# EasyEDA schematic Schematic_Moscow-128_v1.1.0.json
TITLE: Москва-128К; REV: 1.1.0; Date: 2024-11-11; Sheet: 1/1; Drawn By: Roman Boykov; Company: zx-pk.ru
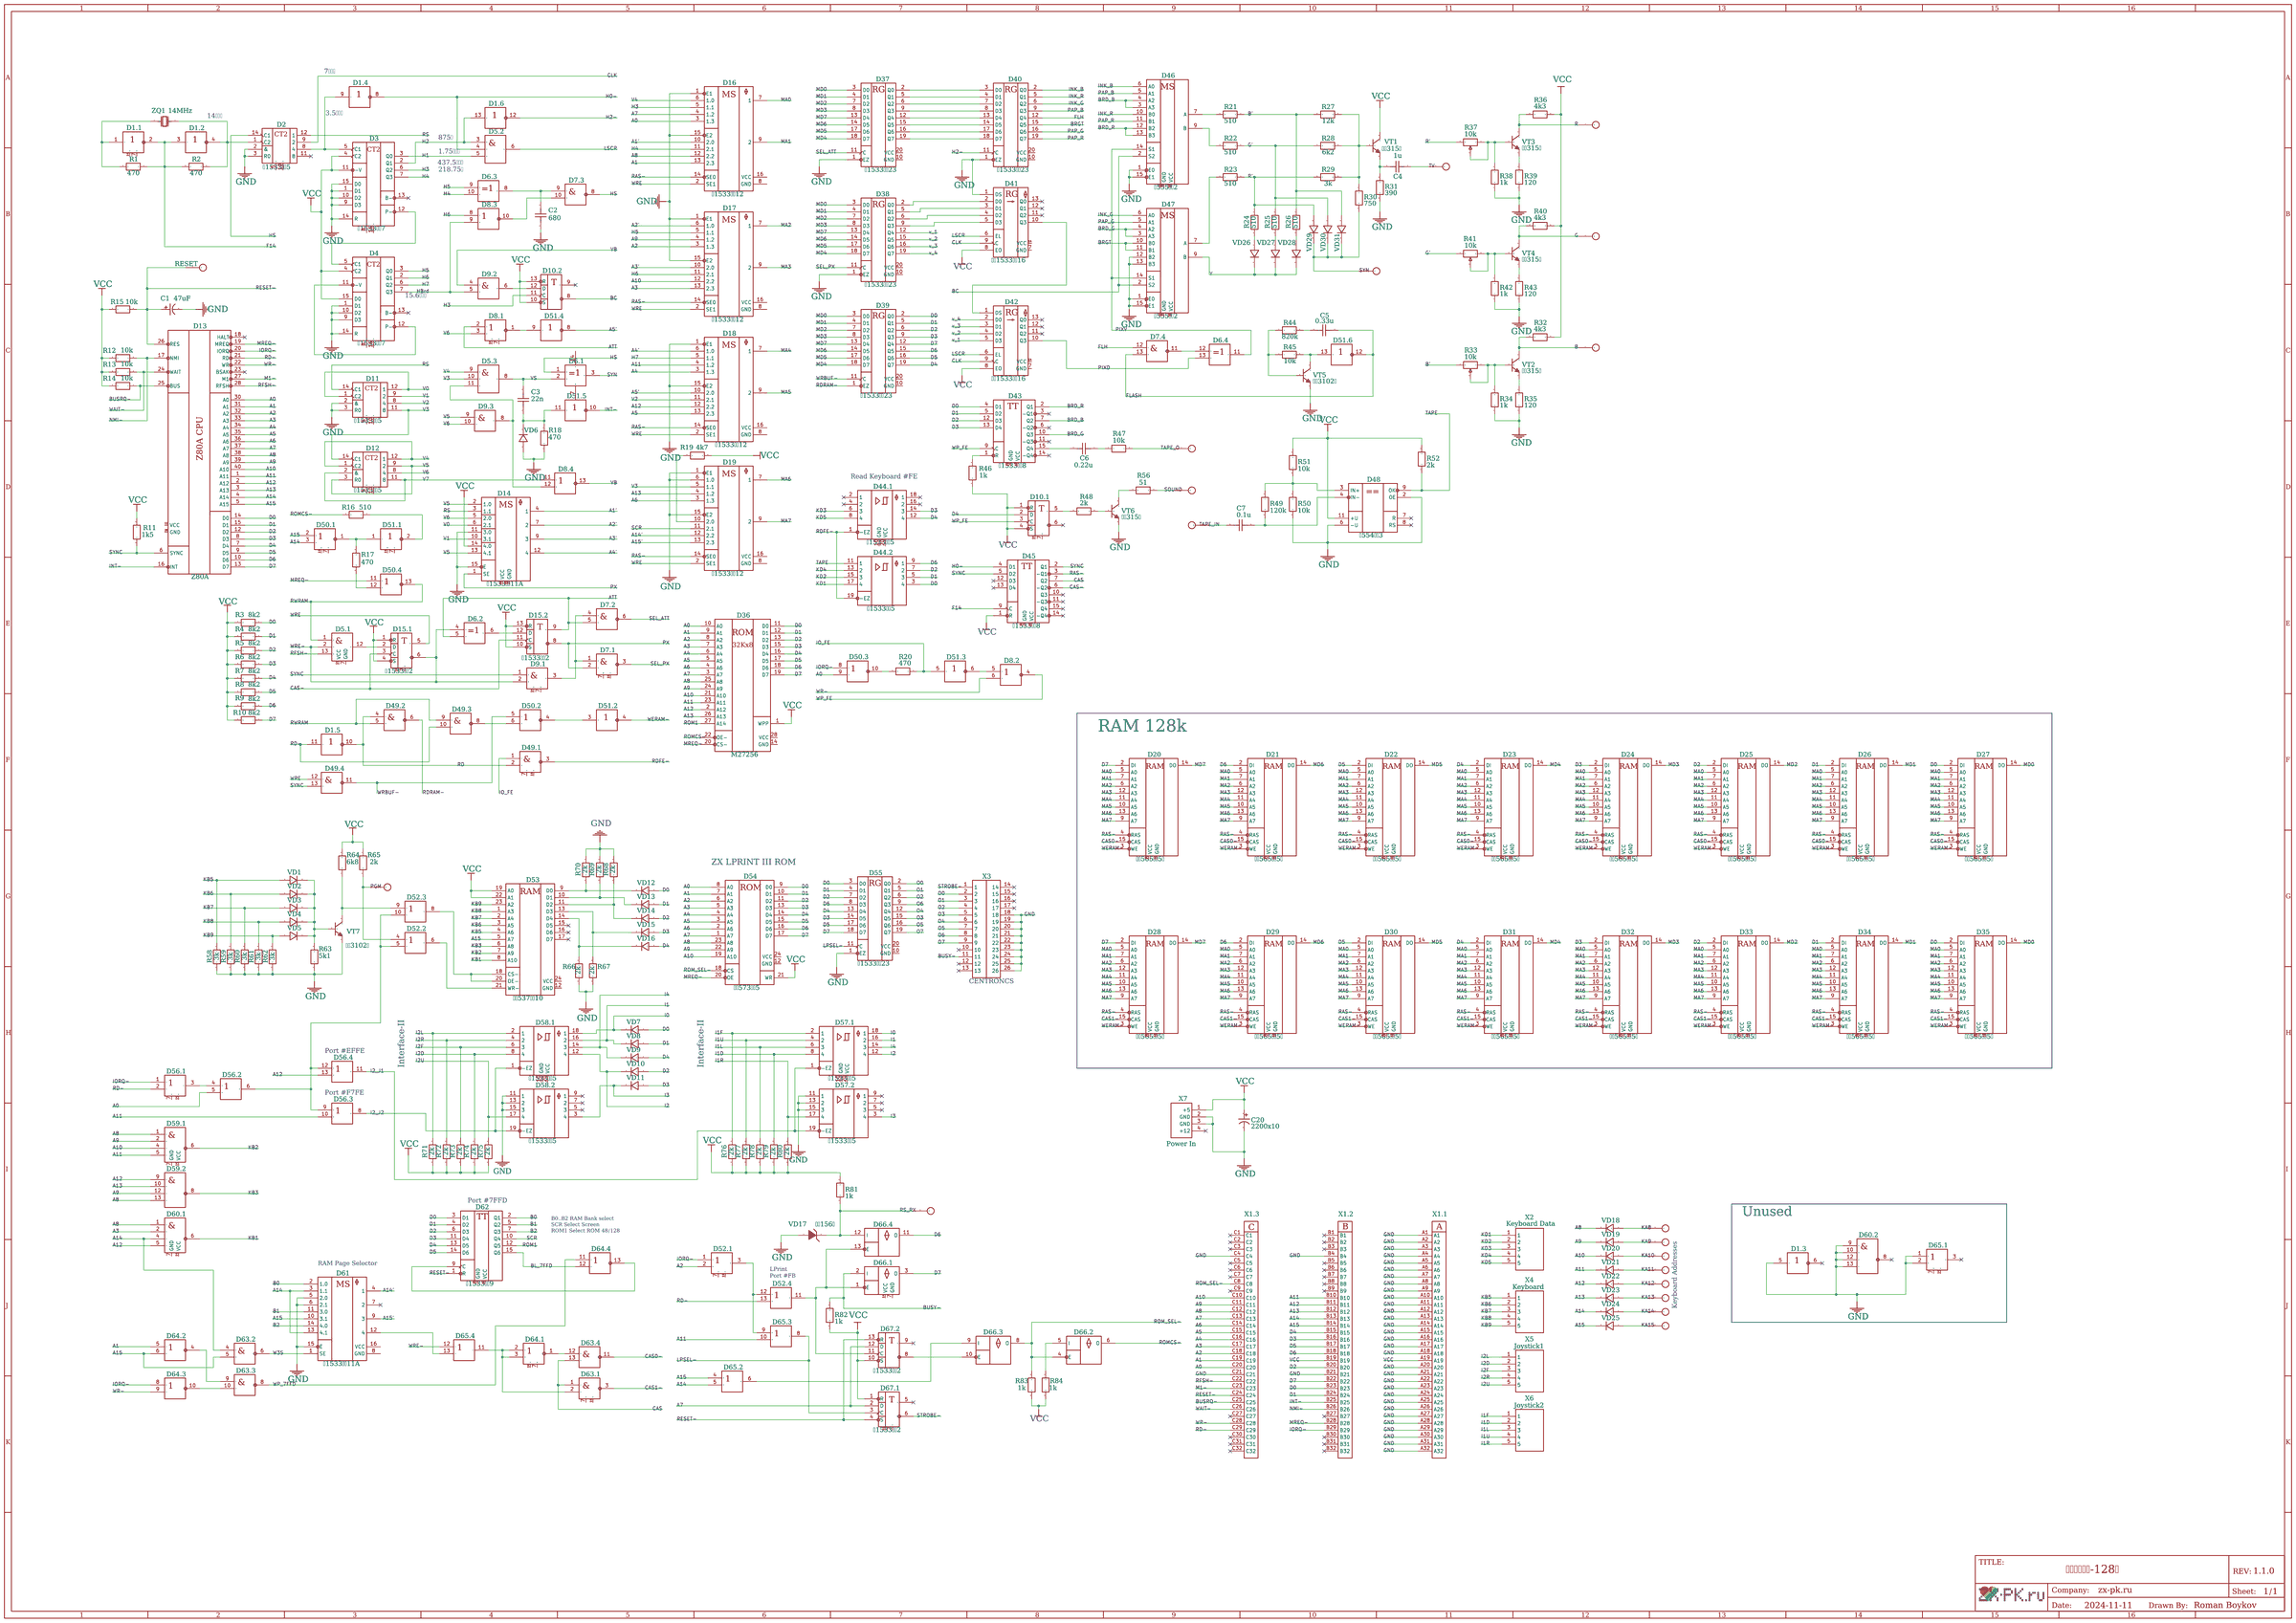
[diagram p0: schematic sheet]

## Parts
C1  47uF  [CAP-TH_BD5.0-P2.50-D1.0-FD]
C2  680  [CAP-TH_L5.08]
C3  22n  [CAP-TH_L5.08]
C4  1u  [CAP-TH_L5.08]
C5  0.33u  [CAP-TH_L5.08]
C6  0.22u  [CAP-TH_L5.08]
C7  0.1u  [CAP-TH_L5.08]
C20  2200x10  [CAP-TH_BD12.5-P5.00-D0.6-FD]
D1  К1533ЛН1  [DIP-14_STD]  (sections 1,2,3,4,5,6)
D2  К1533ИЕ5  [DIP-14_STD]
D3  К1533ИЕ7  [DIP-16_STD]
D4  К1533ИЕ7  [DIP-16_STD]
D5  К1533ЛИ3  [DIP-14_STD]  (sections 1,2,3)
D6  К1533ЛП5  [DIP-14_STD]  (sections 1,2,3,4)
D7  К1533ЛА3  [DIP-14_STD]  (sections 1,2,3,4)
D8  К1533ЛЕ1  [DIP-14_STD]  (sections 1,2,3,4)
D9  К1533ЛИ1  [DIP-14_STD]  (sections 1,2,3)
D10  К1533ТМ2  [DIP-14_STD]  (sections 1,2)
D11  К1533ИЕ5  [DIP-14_STD]
D12  К1533ИЕ5  [DIP-14_STD]
D13  Z80A  [DIP-40_STD]
D14  К1533КП11A  [DIP-16_STD]
D15  К1533ТМ2  [DIP-14_STD]  (sections 1,2)
D16  К1533КП12  [DIP-16_STD]
D17  К1533КП12  [DIP-16_STD]
D18  К1533КП12  [DIP-16_STD]
D19  К1533КП12  [DIP-16_STD]
D20  КР565РУ5Г  [DIP-16_STD]
D21  КР565РУ5Г  [DIP-16_STD]
D22  КР565РУ5Г  [DIP-16_STD]
D23  КР565РУ5Г  [DIP-16_STD]
D24  КР565РУ5Г  [DIP-16_STD]
D25  КР565РУ5Г  [DIP-16_STD]
D26  КР565РУ5Г  [DIP-16_STD]
D27  КР565РУ5Г  [DIP-16_STD]
D28  КР565РУ5Г  [DIP-16_STD]
D29  КР565РУ5Г  [DIP-16_STD]
D30  КР565РУ5Г  [DIP-16_STD]
D31  КР565РУ5Г  [DIP-16_STD]
D32  КР565РУ5Г  [DIP-16_STD]
D33  КР565РУ5Г  [DIP-16_STD]
D34  КР565РУ5Г  [DIP-16_STD]
D35  КР565РУ5Г  [DIP-16_STD]
D36  M27256  [DIP-28_STD]
D37  К1533ИР23  [DIP-20_STD]
D38  К1533ИР23  [DIP-20_STD]
D39  К1533ИР23  [DIP-20_STD]
D40  К1533ИР23  [DIP-20_STD]
D41  КР1533ИР16  [DIP-14_STD]
D42  КР1533ИР16  [DIP-14_STD]
D43  К1533ТМ8  [DIP-16_STD]
D44  К1533АП5  [DIP-20_STD]  (sections 1,2)
D45  К1533ТМ8  [DIP-16_STD]
D46  К555КП2  [DIP-16_STD]
D47  К555КП2  [DIP-16_STD]
D48  К554СА3  [DIP-14_STD]
D49  К1533ЛА3  [DIP-14_STD]  (sections 1,2,3,4)
D50  К1533ЛЕ1  [DIP-14_STD]  (sections 1,2,3,4)
D51  К1533ЛН1  [DIP-14_STD]  (sections 1,2,3,4,5,6)
D52  К1533ЛЛ1  [DIP-14_STD]  (sections 1,2,3,4)
D53  КР537РУ10  [DIP-24_STD]
D54  КР573РФ5  [DIP-24_STD]
D55  К1533ИР23  [DIP-20_STD]
D56  К1533ЛЛ1  [DIP-14_STD]  (sections 1,2,3,4)
D57  К1533АП5  [DIP-20_STD]  (sections 1,2)
D58  К1533АП5  [DIP-20_STD]  (sections 1,2)
D59  К1533ЛА1  [DIP-14_STD]  (sections 1,2)
D60  К1533ЛА1  [DIP-14_STD]  (sections 1,2)
D61  К1533КП11A  [DIP-16_STD]
D62  К1533ТМ9  [DIP-16_STD]
D63  К1533ЛА3  [DIP-14_STD]  (sections 1,2,3,4)
D64  К1533ЛЕ1  [DIP-14_STD]  (sections 1,2,3,4)
D65  К1533ЛЛ1  [DIP-14_STD]  (sections 1,2,3,4)
D66  К155ЛП8  [DIP-14_STD]  (sections 1,2,3,4)
D67  К1533ТМ2  [DIP-14_STD]  (sections 1,2)
R1  470  [R_0.125_5.08]
R2  470  [R_0.125_5.08]
R3  8k2  [R_0.125_7.62]
R4  8k2  [R_0.125_7.62]
R5  8k2  [R_0.125_5.08]
R6  8k2  [R_0.125_7.62]
R7  8k2  [R_0.125_5.08]
R8  8k2  [R_0.125_7.62]
R9  8k2  [R_0.125_V_TH]
R10  8k2  [R_0.125_V_TH]
R11  1k5  [R_0.125_7.62]
R12  10k  [R_0.125_7.62]
R13  10k  [R_0.125_7.62]
R14  10k  [R_0.125_7.62]
R15  10k  [R_0.125_7.62]
R16  510  [R_0.125_L6.35]
R17  470  [R_0.125_L6.35]
R18  470  [R_0.125_7.62]
R19  4k7  [R_0.125_7.62]
R20  470  [R_0.125_7.62]
R21  510  [R_0.125_5.08]
R22  510  [R_0.125_5.08]
R23  510  [R_0.125_5.08]
R24  510  [R_0.125_5.08]
R25  510  [R_0.125_5.08]
R26  510  [R_0.125_5.08]
R27  12k  [R_0.125_5.08]
R28  6k2  [R_0.125_5.08]
R29  3k  [R_0.125_5.08]
R30  750  [R_0.125_5.08]
R31  390  [R_0.125_V_TH]
R32  4k3  [R_0.125_5.08]
R33  10k  [RV_3266W_P2.54]
R34  1k  [R_0.125_V_TH]
R35  120  [R_0.125_5.08]
R36  4k3  [R_0.125_5.08]
R37  10k  [RV_3266W_P2.54]
R38  1k  [R_0.125_V_TH]
R39  120  [R_0.125_5.08]
R40  4k3  [R_0.125_5.08]
R41  10k  [RV_3266W_P2.54]
R42  1k  [R_0.125_V_TH]
R43  120  [R_0.125_5.08]
R44  820k  [R_0.125_7.62]
R45  10k  [R_0.125_5.08]
R46  1k  [R_0.125_7.62]
R47  10k  [R_0.125_5.08]
R48  2k  [R_0.125_5.08]
R49  120k  [R_0.125_5.08]
R50  10k  [R_0.125_5.08]
R51  10k  [R_0.125_5.08]
R52  2k  [R_0.125_5.08]
R56  51  [R_0.125_5.08]
R58  3k  [R_0.125_5.08]
R59  3k  [R_0.125_5.08]
R60  3k  [R_0.125_5.08]
R61  3k  [R_0.125_5.08]
R62  3k  [R_0.125_5.08]
R63  5k1  [R_0.125_5.08]
R64  6k8  [R_0.125_7.62]
R65  2k  [R_0.125_7.62]
R66  2k  [R_0.125_5.08]
R67  2k  [R_0.125_5.08]
R68  2k  [R_0.125_5.08]
R69  2k  [R_0.125_5.08]
R70  2k  [R_0.125_5.08]
R71  2k  [R_0.125_5.08]
R72  2k  [R_0.125_5.08]
R73  2k  [R_0.125_5.08]
R74  2k  [R_0.125_5.08]
R75  2k  [R_0.125_5.08]
R76  2k  [R_0.125_5.08]
R77  2k  [R_0.125_5.08]
R78  2k  [R_0.125_5.08]
R79  2k  [R_0.125_5.08]
R80  2k  [R_0.125_5.08]
R81  1k  [R_0.125_V_TH]
R82  1k  [R_0.125_V_TH]
R83  1k  [R_0.125_5.08]
R84  1k  [R_0.125_7.62]
TP1  TO  [TH-TEST-1]
TP2  SO  [TH-TEST-1]
TP3  TI  [TH-TEST-1]
TP4  RESET  [TH-TEST-1]
TP5  KA8  [TH-TEST-1]
TP6  KA9  [TH-TEST-1]
TP7  KA10  [TH-TEST-1]
TP8  KA11  [TH-TEST-1]
TP9  KA12  [TH-TEST-1]
TP10  KA13  [TH-TEST-1]
TP11  KA14  [TH-TEST-1]
TP12  KA15  [TH-TEST-1]
TP13  R  [TH-TEST-1]
TP14  G  [TH-TEST-1]
TP15  B  [TH-TEST-1]
TP16  SYNC  [TH-TEST-1]
TP17  BW/TV  [TH-TEST-1]
TP18  RS_RX  [TH-TEST-1]
TP19  PGM  [TH-TEST-1]
VD1  1N4148  [D_TH_3_3.81V]
VD2  1N4148  [D_TH_3_3.81V]
VD3  1N4148  [D_TH_3_3.81V]
VD4  1N4148  [D_TH_3_3.81V]
VD5  1N4148  [D_TH_3_3.81V]
VD6  1N4148  [D_TH_7.62]
VD7  1N4148  [DO-35_TH_5.08V]
VD8  1N4148  [DO-35_TH_5.08V]
VD9  1N4148  [DO-35_TH_5.08V]
VD10  1N4148  [DO-35_TH_5.08V]
VD11  1N4148  [DO-35_TH_5.08V]
VD12  1N4148  [DO-35_TH_5.08V]
VD13  1N4148  [DO-35_TH_5.08V]
VD14  1N4148  [DO-35_TH_5.08V]
VD15  1N4148  [DO-35_TH_5.08V]
VD16  1N4148  [DO-35_TH_5.08V]
VD17  КС156А  [D_TH_3_3.81V]
VD18  1N4148  [D_TH_7.62]
VD19  1N4148  [D_TH_7.62]
VD20  1N4148  [D_TH_7.62]
VD21  1N4148  [D_TH_7.62]
VD22  1N4148  [D_TH_7.62]
VD23  1N4148  [D_TH_7.62]
VD24  1N4148  [D_TH_7.62]
VD25  1N4148  [D_TH_7.62]
VD26  1N4148  [D_TH_5.08V]
VD27  1N4148  [D_TH_5.08V]
VD28  1N4148  [D_TH_5.08V]
VD29  1N4148  [D_TH_5.08V]
VD30  1N4148  [D_TH_5.08V]
VD31  1N4148  [D_TH_5.08V]
VT1  КТ315Б  [KT315_STD]
VT2  КТ315Б  [KT315_STD]
VT3  КТ315Б  [KT315_STD]
VT4  КТ315Б  [KT315_STD]
VT5  КТ3102Б  [KT-1-7]
VT6  КТ315Б  [KT315_STD]
VT7  КТ3102Б  [KT-1-7]
X1  DIN41612C-96FR  [DIN41612C-96FR]  (sections 1,2,3)
X2  Keyboard Data  [HDR-TH_5P-P2.54]
X3  IDC-TH-26P  [IDC-TH_26P-P2.54M]
X4  Keyboard  [HDR-TH_5P-P2.54]
X5  Joystick1  [HDR-TH_5P-P2.54]
X6  Joystick2  [HDR-TH_5P-P2.54]
X7  Power In  [CONN-TH-4P-JVC_MINI]
ZQ1  14MHz  [OSC-49U-1]

## Library data of the parts
C1 = ECLJ0612220M101P00: Supplier: LCSC; Supplier Part: C156809; Manufacturer: Guangdong TOPAZ Elec Tech; Contributor: LCSC
C2-C7 = CK45-R3AD152K-VRY: Supplier: LCSC; Supplier Part: C340608; Manufacturer: TDK; Contributor: LCSC
C20 = 35ZLJ1200MG412.5X25: Supplier: LCSC; Supplier Part: C1646592; Manufacturer: rubycon(红宝石); link: https://atta.szlcsc.com/upload/public/pdf/source/20210511/C1646592_079297B36C73E9CBE03F43750192AD47.pdf; Contributor: lcsc; JLCPCB Part Class: Extended Part
D1 D51 = К1533ЛН1: Supplier: chipdip; Contributor: Roman Boykov; subpart_no: 7
D2 D11 D12 = К1533ИЕ5: Supplier: chipdip; Contributor: romychs_4693; subpart_no: 4
D3 D4 = К1533ИЕ7: Contributor: romychs_4693
D5 = КР1533ЛИ3: Contributor: romychs_4693; subpart_no: 1
D6 = К1533ЛП5: Supplier: chipdip; Contributor: Roman Boykov; subpart_no: 3
D7 = К1533ЛА3: Supplier: chipdip; Contributor: Roman Boykov; subpart_no: 3
D8 = К1533ЛЕ1: Supplier: chipdip; Contributor: Roman Boykov; subpart_no: 3
D9 = К1533ЛИ1: Supplier: chipdip; Contributor: Roman Boykov; subpart_no: 3
D10 D15 D67 = К1533ТМ2: Supplier: chipdip; Contributor: romychs_4693; subpart_no: 4
D13 = Z80A: Manufacturer: Zilog; Contributor: romychs_4693
D14 D61 = К1533КП11A: Supplier: chipdip; Contributor: Roman Boykov
D16-D19 = К1533КП12: Supplier: chipdip; Contributor: romychs_4693
D20-D35 = КР565РУ5Г: Supplier: chipdip; Contributor: romychs_4693
D36 = M27256: Supplier: chipdip; Contributor: romychs_4693
D37-D40 D55 = К1533ИР23: Supplier: chipdip; link: TTL; Регистр; ИР23; Contributor: romychs_4693
D41 D42 = КР1533ИР16: Supplier: chipdip; Contributor: romychs_4693
D43 D45 = К1533ТМ8: Supplier: chipdip; Contributor: Roman Boykov
D44 D57 D58 = К1533АП5: Contributor: romychs_4693; subpart_no: 1
D46 D47 = К555КП2: Supplier: chipdip; Contributor: romychs_4693
D48 = К554СА3: Contributor: romychs_4693
D49 D63 = К1533ЛА3: Supplier: chipdip; Contributor: Roman Boykov; subpart_no: 1
D50 D64 = К1533ЛЕ1: Supplier: chipdip; Contributor: Roman Boykov; subpart_no: 1
D52 D56 D65 = К1533ЛЛ1: Supplier: chipdip; Contributor: Roman Boykov; subpart_no: 3
D53 = КР537РУ10: Contributor: romychs_4693
D54 = КР573РФ5: Contributor: Roman Boykov
D59 = К1533ЛА1: Supplier: chipdip; Contributor: romychs_4693; subpart_no: 1
D60 = К1533ЛА1: Supplier: chipdip; Contributor: romychs_4693; subpart_no: 2
D62 = К1533ТМ9: Supplier: chipdip; Contributor: Roman Boykov
D66 = К155ЛП8: Contributor: Roman Boykov; subpart_no: 1
R1-R32 R34-R36 R38-R40 R42-R52 R56 R58-R84 = RN 1/8W 470R F T/B A1: Supplier: LCSC; Supplier Part: C433478; Manufacturer: TyoHM; Contributor: LCSC
R33 R37 R41 = R_3386P_EU: Supplier: LCSC; Contributor: LCEDA_Lib; Value(Ω): 10K
TP1-TP19 = TH-TEST-1: Contributor: romychs_4693
VD1-VD16 VD18-VD31 = 1N4148: Contributor: EasyEDA
VD17 = 1N4742A: Supplier: LCSC; Manufacturer: Tak Cheong; Supplier Part: C113210; JLCPCB Part Class: Extended Part
VT1-VT4 VT6 = КТ315Б: Supplier: LCSC; Manufacturer: Russia; Manufacturer Part: КТ315; Supplier Part: КТ315; JLCPCB Part Class: Extended Part
VT5 VT7 = КТ3102Б: Supplier: LCSC; Manufacturer: Russia; Manufacturer Part: КТ315; Supplier Part: КТ315; JLCPCB Part Class: Extended Part
X1 = DIN41612C-96FR: Contributor: Roman Boykov; subpart_no: 1
X2 X4-X6 = PinHeader_1x5: Contributor: Roman Boykov
X3 = IDC-TH-26P: Contributor: Roman Boykov
X7 = JVC Mini-4P: Contributor: romychs_4693
ZQ1 = X49UD12MSD2SC: Supplier: LCSC; Manufacturer: YXC; Supplier Part: C2188

## Nets
GND: C1.2 C2.1 C20.2 D1.5(1) D2.2(&) D2.3(R0) D3.1(D1) D3.9(D3) D3.10(D2) D3.14(R) D3.15(D0) D4.1(D1) D4.9(D3) D4.10(D2) D4.14(R) D11.2(&) D11.3(R0) D14.11(3.0) D14.15(E) D16.1(E1) D16.15(E2) D17.1(E1) D17.15(E2) D18.1(E1) D18.15(E2) D19.1(E1) D19.6(1.0) D19.15(E2) D37.1(EZ) D38.1(EZ) D40.1(EZ) D41.1(DS) D46.1(E0) D46.15(E1) D47.1(E0) D47.12(B2) D47.13(B3) D47.15(E1) D48.2(OE) D48.6(-U) D55.1(EZ) D57.11(1) D57.13(2) D57.15(3) D58.11(1) D58.13(2) D58.15(3) D60.9(1) D60.10(2) D60.12(3) D60.13(4) D61.5(2.0) D61.6(2.1) D61.15(E) D65.1 D65.2 R18.1 R31.2 R34.1 R35.1 R38.1 R39.1 R42.1 R43.1 R50.2 R58.1 R59.1 R60.1 R61.1 R62.1 R63.1 R66.2 R67.2 R68.1 R69.1 R70.1 VD6.1(A) VD17.1(A) VT5.1(E) VT6.1(E) VT7.1(E) X1.A1 X1.A2 X1.A3 X1.A4 X1.A5 X1.A6 X1.A7 X1.A8 X1.A9 X1.A10 X1.A11 X1.A12 X1.A13 X1.A14 X1.A15 X1.A16 X1.A17 X1.A18 X1.A20 X1.A21 X1.A22 X1.A23 X1.A24 X1.A25 X1.A26 X1.A27 X1.A28 X1.A29 X1.A30 X1.A31 X1.A32 X1.B4 X1.B21 X1.C4 X1.C21 X3.18 X3.19 X3.20 X3.21 X3.22 X3.23 X3.24 X3.25 X3.26 X7.2(GND) X7.3(GND)
V0: D11.1(C2) D11.12(1) D14.6(2.1)
V1: D11.9(2) D14.10(3.1)
V2: D11.8(4) D18.11(2.1)
V3: D5.10(I2) D11.11(8) D12.14(C1) D19.5(1.1)
V4: D5.9(I1) D12.1(C2) D12.12(1) D16.6(1.0)
V5: D9.9(1) D12.3(R0) D12.9(2) D14.2(1.0) D14.13(4.1)
V6: D8.3(2) D9.10(2) D12.8(4) D14.5(2.0)
V7: D8.11(1) D12.2(&) D12.11(8)
VCC: C20.1 D3.4(C2) D3.11(-V) D4.4(C2) D4.15(D0) D10.1(R) D10.4(S) D10.10(S) D10.13(R) D14.14(4.0) D15.1(R) D15.4(S) D15.10(S) D15.13(R) D36.1(WPP) D41.8(EO) D42.8(EO) D45.1(R) D48.11(+U) D53.19(A0) D53.22(A1) D54.21(WR) D67.1(R) D67.10(S) R3.2 R4.2 R5.2 R6.2 R7.1 R8.2 R9.1 R10.2 R11.1 R12.2 R13.2 R14.2 R15.2 R19.1 R32.1 R36.1 R40.1 R46.1 R51.1 R52.2 R64.2 R65.1 R71.2 R72.2 R73.2 R74.2 R75.2 R76.2 R77.2 R78.2 R79.2 R80.2 R81.2 R82.2 R83.1 R84.2 VT1.2(C) X1.A19 X1.B19 X7.1(+5)
A0: D13.30(A0) D16.3(1.3) D36.10(A0) D50.9(2) D54.8(A0) D56.5(2) X1.C20
A1: D13.31(A1) D16.13(2.3) D36.9(A1) D54.7(A1) D64.5(1) X1.C19
A1': D14.4(1) D16.10(2.0)
A2: D13.32(A2) D17.3(1.3) D36.8(A2) D52.2 D54.6(A2) X1.C18
A2': D14.7(2) D17.6(1.0)
A3: D13.33(A3) D17.13(2.3) D36.7(A3) D54.5(A3) D60.2 X1.C17
A3': D14.9(3) D17.10(2.0)
A4: D13.34(A4) D18.3(1.3) D36.6(A4) D54.4(A4) X1.C16
A4': D14.12(4) D18.6(1.0)
A5: D13.35(A5) D18.13(2.3) D36.5(A5) D54.3(A5) X1.C15
A5': D18.10(2.0) D51.8(2)
A6: D13.36(A6) D19.3(1.3) D36.4(A6) D54.2(A6) X1.C14
A7: D13.37(A7) D16.4(1.2) D36.3(A7) D54.1(A7) D67.2(D) D67.12(D) X1.C13
A8: D13.38(A8) D16.12(2.2) D36.25(A8) D54.23(A8) D59.1 D59.13(4) D60.1 VD18.2(K) X1.C12
A9: D13.39(A9) D17.4(1.2) D36.24(A9) D54.22(A9) D59.2 D59.12(3) VD19.2(K) X1.C11
A10: D13.40(A10) D17.12(2.2) D36.21(A10) D54.19(A10) D59.4(3) VD20.2(K) X1.C10
A11: D13.1(A11) D18.4(1.2) D36.23(A11) D56.10(2) D59.5(4) D65.10(2) VD21.2(K) X1.B10
A12: D13.2(A12) D18.12(2.2) D36.2(A12) D56.13(2) D59.9(1) D60.5(4) VD22.2(K) X1.B11
A13: D13.3(A13) D19.4(1.2) D36.26(A13) D59.10(2) VD23.2(K) X1.B12
A14: D13.4(A14) D50.3(2) D60.4(3) D61.3(1.1) D61.13(4.1) D63.4(1) D65.5(2) VD24.2(K) X1.B13
A14': D19.12(2.2) D61.4(1)
A15: D13.5(A15) D50.2(1) D53.5(A7) D61.10(3.1) D63.5(2) D64.6(2) D65.4(1) VD25.2(K) X1.B14
A15': D19.13(2.3) D61.9(3)
ATT: D6.5(2) D7.5(2) D8.2(1) D15.9(Q)
B: R32.2 TP15.1(TP1) VT2.2(C)
B0: D61.2(1.0) D62.2(Q1)
B1: D61.11(3.0) D62.5(Q2)
B2: D61.14(4.0) D62.7(Q3)
B': R21.1 R26.1 R27.2 R33.3 VD31.1(A)
BC: D10.8(-Q) D46.2(S2) D47.2(S2)
BL_7FFD: D62.15(Q6) D64.12(2)
BRD_B: D43.7(Q2) D46.3(A3) D46.4(A2)
BRD_G: D43.10(Q3) D47.3(A3) D47.4(A2)
BRD_R: D43.2(Q1) D46.12(B2) D46.13(B3)
BRGT: D40.15(Q5) D47.10(B0) D47.11(B1)
BUSRQ-: D13.25(BUS) R14.1 X1.C25
BUSY-: D66.2(I) R82.1 X3.11
CAS: D45.7(Q2) D63.1 D63.13(2)
CAS0-: D20.15(CAS) D21.15(CAS) D22.15(CAS) D23.15(CAS) D24.15(CAS) D25.15(CAS) D26.15(CAS) D27.15(CAS) D63.11(3)
CAS1-: D28.15(CAS) D29.15(CAS) D30.15(CAS) D31.15(CAS) D32.15(CAS) D33.15(CAS) D34.15(CAS) D35.15(CAS) D63.3
CAS-: D15.3(С) D15.11(C) D45.6(-Q2)
CLK: D2.9(2) D41.9(C) D42.9(C)
D0: D13.14(D0) D27.2(DI) D35.2(DI) D36.11(D0) D39.2(Q0) D43.4(D1) D44.3(4) D54.9(D0) D55.3(D0) D62.3(D1) R3.1 VD7.1(A) VD12.1(A) X1.B23
D1: D13.15(D1) D26.2(DI) D34.2(DI) D36.12(D1) D39.5(Q1) D43.5(D2) D44.5(3) D54.10(D1) D55.4(D1) D62.4(D2) R4.1 VD8.1(A) VD13.1(A) X1.B24
D2: D13.12(D2) D25.2(DI) D33.2(DI) D36.13(D2) D39.6(Q2) D43.12(D3) D44.7(2) D54.11(D2) D55.7(D2) D62.6(D3) R5.1 VD10.1(A) VD14.1(A) X1.B20
D3: D13.8(D3) D24.2(DI) D32.2(DI) D36.15(D3) D39.9(Q3) D43.13(D4) D44.14(3) D54.13(D3) D55.14(D5) D62.11(D4) R6.1 VD11.1(A) VD15.1(A) X1.B16
D4: D10.2(D) D13.7(D4) D23.2(DI) D31.2(DI) D36.16(D4) D39.19(Q7) D44.12(4) D54.14(D4) D55.13(D4) D62.13(D5) R7.2 VD9.1(A) VD16.1(A) X1.B15
D5: D13.9(D5) D22.2(DI) D30.2(DI) D36.17(D5) D39.16(Q6) D54.15(D5) D55.17(D6) D62.14(D6) R8.1 X1.B17
D6: D13.10(D6) D21.2(DI) D29.2(DI) D36.18(D6) D39.15(Q5) D44.9(1) D54.16(D6) D55.8(D3) D66.11(O) R9.2 X1.B18
D7: D13.13(D7) D20.2(DI) D28.2(DI) D36.19(D7) D39.12(Q4) D54.17(D7) D55.18(D7) D66.3(O) R10.1 X1.B22
F14: D1.2 D1.3(1) D45.9(C) R1.1 R2.2
FLASH: C5.1 D7.13(2) D51.12(2)
FLH: D7.12(1) D40.12(Q4)
G: R40.2 TP14.1(TP1) VT4.2(C)
G': R22.1 R25.1 R28.2 R41.1 VD30.1(A)
H0-: D1.8(2) D5.4(I2) D45.4(D1)
H1: D3.3(Q0) D5.5(I3)
H2: D1.13(1) D3.2(Q1) D5.3(I1)
H2-: D1.12(2) D40.11(C)
H3: D3.6(Q2) D10.11(C) D16.5(1.1)
H4: D3.7(Q3) D6.10(2) D16.11(2.1)
H5: D4.3(Q0) D6.9(1) D17.5(1.1)
H6: D4.2(Q1) D8.8(1) D17.11(2.1)
H7: D4.6(Q2) D18.5(1.1)
HBrd: D4.7(Q3) D8.9(2) D9.5(2)
HS: D2.14(C1) D6.1 D7.8(3)
I0: D57.18(1) D58.18(1) VD7.2(K)
I1: D57.16(2) D58.16(2) VD8.2(K)
I1D: D57.8(4) R79.1 X6.2
I1F: D57.2(1) R76.1 X6.1
I1L: D57.6(3) R78.1 X6.3
I1R: D57.17(4) R80.1 X6.5
I1U: D57.4(2) R77.1 X6.4
I2: D57.12(4) D58.12(4) VD10.2(K)
I2_J1: D56.11(3) D57.1(-EZ) D57.19(-EZ)
I2_J2: D56.8(3) D58.1(-EZ) D58.19(-EZ)
I2D: D58.8(4) R74.1 X5.2
I2F: D58.6(3) R73.1 X5.3
I2L: D58.2(1) R71.1 X5.1
I2R: D58.4(2) R72.1 X5.4
I2U: D58.17(4) R75.1 X5.5
I3: D57.3(4) D58.3(4) VD11.2(K)
I4: D57.14(3) D58.14(3) VD9.2(K)
INK_B: D40.2(Q0) D46.6(A0)
INK_G: D40.6(Q2) D47.6(A0)
INK_R: D40.5(Q1) D46.10(B0)
INT-: D13.16(INT) D51.10(2) X1.B25
IO_FE: D49.1 D51.5(1) R20.1
IORQ-: D13.20(IORQ) D50.8(1) D52.1 D56.1 D64.8(1) X1.B29
KA8: TP5.1(TP1) VD18.1(A)
KA9: TP6.1(TP1) VD19.1(A)
KA10: TP7.1(TP1) VD20.1(A)
KA11: TP8.1(TP1) VD21.1(A)
KA12: TP9.1(TP1) VD22.1(A)
KA13: TP10.1(TP1) VD23.1(A)
KA14: TP11.1(TP1) VD24.1(A)
KA15: TP12.1(TP1) VD25.1(A)
KB1: D53.8(A10) D60.6(5)
KB2: D53.7(A9) D59.6(5)
KB3: D53.6(A8) D59.8(5)
KB5: D53.4(A6) R58.2 VD1.1(A) X4.1
KB6: D53.3(A5) R59.2 VD2.1(A) X4.2
KB7: D53.2(A4) R60.2 VD3.1(A) X4.3
KB8: D53.1(A3) R61.2 VD4.1(A) X4.4
KB9: D53.23(A2) R62.2 VD5.1(A) X4.5
KD1: D44.17(4) X2.1
KD2: D44.15(3) X2.2
KD3: D44.6(3) X2.3
KD4: D44.13(2) X2.4
KD5: D44.8(4) X2.5
LPSEL-: D55.11(C) D65.8(3) D67.3(С)
LSCR: D5.6(O1) D41.6(EL) D42.6(EL)
M1-: D13.27(M1) X1.C23
MA0: D16.7(1) D20.5(A0) D21.5(A0) D22.5(A0) D23.5(A0) D24.5(A0) D25.5(A0) D26.5(A0) D27.5(A0) D28.5(A0) D29.5(A0) D30.5(A0) D31.5(A0) D32.5(A0) D33.5(A0) D34.5(A0) D35.5(A0)
MA1: D16.9(2) D20.7(A1) D21.7(A1) D22.7(A1) D23.7(A1) D24.7(A1) D25.7(A1) D26.7(A1) D27.7(A1) D28.7(A1) D29.7(A1) D30.7(A1) D31.7(A1) D32.7(A1) D33.7(A1) D34.7(A1) D35.7(A1)
MA2: D17.7(1) D20.6(A2) D21.6(A2) D22.6(A2) D23.6(A2) D24.6(A2) D25.6(A2) D26.6(A2) D27.6(A2) D28.6(A2) D29.6(A2) D30.6(A2) D31.6(A2) D32.6(A2) D33.6(A2) D34.6(A2) D35.6(A2)
MA3: D17.9(2) D20.12(A3) D21.12(A3) D22.12(A3) D23.12(A3) D24.12(A3) D25.12(A3) D26.12(A3) D27.12(A3) D28.12(A3) D29.12(A3) D30.12(A3) D31.12(A3) D32.12(A3) D33.12(A3) D34.12(A3) D35.12(A3)
MA4: D18.7(1) D20.11(A4) D21.11(A4) D22.11(A4) D23.11(A4) D24.11(A4) D25.11(A4) D26.11(A4) D27.11(A4) D28.11(A4) D29.11(A4) D30.11(A4) D31.11(A4) D32.11(A4) D33.11(A4) D34.11(A4) D35.11(A4)
MA5: D18.9(2) D20.10(A5) D21.10(A5) D22.10(A5) D23.10(A5) D24.10(A5) D25.10(A5) D26.10(A5) D27.10(A5) D28.10(A5) D29.10(A5) D30.10(A5) D31.10(A5) D32.10(A5) D33.10(A5) D34.10(A5) D35.10(A5)
MA6: D19.7(1) D20.13(A6) D21.13(A6) D22.13(A6) D23.13(A6) D24.13(A6) D25.13(A6) D26.13(A6) D27.13(A6) D28.13(A6) D29.13(A6) D30.13(A6) D31.13(A6) D32.13(A6) D33.13(A6) D34.13(A6) D35.13(A6)
MA7: D19.9(2) D20.9(A7) D21.9(A7) D22.9(A7) D23.9(A7) D24.9(A7) D25.9(A7) D26.9(A7) D27.9(A7) D28.9(A7) D29.9(A7) D30.9(A7) D31.9(A7) D32.9(A7) D33.9(A7) D34.9(A7) D35.9(A7)
MD0: D27.14(DO) D35.14(DO) D37.3(D0) D38.3(D0) D39.3(D0)
MD1: D26.14(DO) D34.14(DO) D37.4(D1) D38.4(D1) D39.4(D1)
MD2: D25.14(DO) D33.14(DO) D37.7(D2) D38.7(D2) D39.7(D2)
MD3: D24.14(DO) D32.14(DO) D37.8(D3) D38.8(D3) D39.8(D3)
MD4: D23.14(DO) D31.14(DO) D37.18(D7) D38.18(D7) D39.18(D7)
MD5: D22.14(DO) D30.14(DO) D37.17(D6) D38.17(D6) D39.17(D6)
MD6: D21.14(DO) D29.14(DO) D37.14(D5) D38.14(D5) D39.14(D5)
MD7: D20.14(DO) D28.14(DO) D37.13(D4) D38.13(D4) D39.13(D4)
MREQ-: D13.19(MREQ) D36.20(CS-) D50.11(1) D54.20(OE) X1.B28
NMI-: D13.17(NMI) R12.1 X1.B26
O0: D55.2(Q0) X3.2
O1: D55.5(Q1) X3.3
O2: D55.6(Q2) X3.4
O3: D55.15(Q5) X3.5
O4: D55.12(Q4) X3.6
O5: D55.16(Q6) X3.7
O6: D55.9(Q3) X3.8
O7: D55.19(Q7) X3.9
PAP_B: D40.9(Q3) D46.5(A1)
PAP_G: D40.16(Q6) D47.5(A1)
PAP_R: D40.19(Q7) D46.11(B1)
PGM: D52.4(1) R65.2 TP19.1(TP1)
PIXD: D6.13(2) D42.10(Q3)
PIXV: D6.11(3) D46.14(S1) D47.14(S1)
PX: D7.2 D14.1(SE) D15.8(-Q)
R: R36.2 TP13.1(TP1) VT3.2(C)
R': R23.1 R24.1 R29.2 R37.3 VD29.1(A)
RAS-: D16.14(SE0) D17.14(SE0) D18.14(SE0) D19.14(SE0) D20.4(RAS) D21.4(RAS) D22.4(RAS) D23.4(RAS) D24.4(RAS) D25.4(RAS) D26.4(RAS) D27.4(RAS) D28.4(RAS) D29.4(RAS) D30.4(RAS) D31.4(RAS) D32.4(RAS) D33.4(RAS) D34.4(RAS) D35.4(RAS) D45.3(-Q1)
RD: D1.10(2) D49.2 D49.4(1)
RD-: D1.11(1) D13.21(RD) D49.10(2) D52.13(2) D56.2 X1.C29
RDFE-: D44.1(-EZ) D44.19(-EZ) D49.3
RDRAM-: D39.1(EZ) D49.6(3)
RESET-: C1.1 D13.26(RES) D62.1(R) D67.4(S) D67.13(R) R15.1 TP4.1(TP1) X1.C24
RFSH-: D5.13(I3) D13.28(RFSH) X1.C22
ROM1: D36.27(A14) D62.12(Q5)
ROM_SEL-: D54.18(CS) D66.4(E) D66.8(O) R83.2 X1.C8
ROMCS-: D36.22(OE-) D66.6(O) R16.2
RS: D2.12(1) D11.14(C1) D14.3(1.1)
RS_RX: D66.12(I) R81.1 TP18.1(TP1) VD17.2(K)
RWRAM: D5.1(I1) D49.5(2) D49.9(1) D50.13(3)
SCR: D19.11(2.1) D62.10(Q4)
SEL_ATT: D7.6(3) D37.11(C)
SEL_PX: D7.3 D38.11(C)
SOUND: R56.2 TP2.1(TP1)
STROBE-: D67.6(&#126;Q) X3.1
SYN: D6.3 R30.2 TP16.1(TP1) VD29.2(K) VD30.2(K) VD31.2(K)
SYNC: D9.1 D13.6(SYNC) D45.2(Q1) D45.5(D2) D49.13(2) R11.2
TAPE: D44.11(1) D48.9(OK) R52.1
TAPE_IN: C7.2 TP3.1(TP1)
TAPE_O: R47.2 TP1.1(TP1)
TV: C4.1 TP17.1(TP1)
v_1: D38.12(Q4) D42.5(D3)
v_2: D38.15(Q5) D42.4(D2)
v_3: D38.16(Q6) D42.3(D1)
v_4: D38.19(Q7) D42.2(D0)
VB: D8.13(3) D9.4(1)
VS: C3.2 D5.8(O1) D6.2
W3S: D61.1(SE) D63.6(3)
WAIT-: D13.24(WAIT) R13.1 X1.C26
WERAM-: D20.3(WE) D21.3(WE) D22.3(WE) D23.3(WE) D24.3(WE) D25.3(WE) D26.3(WE) D27.3(WE) D28.3(WE) D29.3(WE) D30.3(WE) D31.3(WE) D32.3(WE) D33.3(WE) D34.3(WE) D35.3(WE) D51.4(2)
WP_7FFD: D63.8(3) D64.11(1)
WP_FE: D8.4(3) D10.3(С) D43.9(C)
WR-: D8.6(2) D13.22(WR) D64.9(2) X1.C28
WRBUF-: D39.11(C) D49.11(3) D50.5(1)
WRE: D15.5(Q) D16.2(SE1) D17.2(SE1) D18.2(SE1) D19.2(SE1) D49.12(1)
WRE-: D5.2(I2) D6.4(1) D9.2 D15.6(&#126;Q) D65.12(1)
Y: D47.9(B) VD26.2(K) VD27.2(K) VD28.2(K)
Net-(C2-2): C2.2 D6.8(3) D7.9(1)
Net-(C3-1): C3.1 D51.11(1) R18.2 VD6.2(K)
Net-(C4-2): C4.2 R31.1 VT1.1(E)
Net-(C5-2): C5.2 R44.2
Net-(C6-1): C6.1 R47.1
Net-(C6-2): C6.2 D43.15(Q4)
Net-(C7-1): C7.1 D48.4(IN-) R49.2
Net-(D1.1-1): D1.1 R1.2 ZQ1.2(OSC2)
Net-(D1.2-4): D1.4(2) D2.1(C2) R2.1 ZQ1.1(OSC1)
Net-(D1.4-9): D1.9(1) D2.8(4) D3.5(C1)
Net-(D3-12): D3.12(P-) D4.5(C1)
Net-(D4-11): D4.11(-V) D4.12(P-)
Net-(D5.1-12): D5.12(O1) D15.2(D)
Net-(D5.3-11): D5.11(I3) D8.12(2) D9.8(3)
Net-(D6.2-6): D6.6(3) D15.12(D)
Net-(D6.4-12): D6.12(1) D7.11(3)
Net-(D7.1-1): D7.1 D7.4(1) D9.3
Net-(D7.3-10): D7.10(2) D8.10(3)
Net-(D8.1-1): D8.1(3) D51.9(1)
Net-(D8.2-5): D8.5(1) D51.6(2)
Net-(D9.2-6): D9.6(3) D10.12(D)
Net-(D10.1-5): D10.5(Q) R48.2
Net-(D19-10): D19.10(2.0) R19.2
Net-(D37-2): D37.2(Q0) D40.3(D0)
Net-(D37-5): D37.5(Q1) D40.4(D1)
Net-(D37-6): D37.6(Q2) D40.7(D2)
Net-(D37-9): D37.9(Q3) D40.8(D3)
Net-(D37-12): D37.12(Q4) D40.13(D4)
Net-(D37-15): D37.15(Q5) D40.14(D5)
Net-(D37-16): D37.16(Q6) D40.17(D6)
Net-(D37-19): D37.19(Q7) D40.18(D7)
Net-(D38-2): D38.2(Q0) D41.2(D0)
Net-(D38-5): D38.5(Q1) D41.3(D1)
Net-(D38-6): D38.6(Q2) D41.4(D2)
Net-(D38-9): D38.9(Q3) D41.5(D3)
Net-(D41-10): D41.10(Q3) D42.1(DS)
Net-(D43-1): D43.1(R) R46.2
Net-(D46-7): D46.7(A) R21.2
Net-(D46-9): D46.9(B) R22.2
Net-(D47-7): D47.7(A) R23.2
Net-(D48-3): D48.3(IN+) R49.1 R50.1 R51.2
Net-(D49.3-8): D49.8(3) D50.6(2)
Net-(D50.1-1): D50.1(3) D51.1 R17.2
Net-(D50.2-4): D50.4(3) D51.3(1)
Net-(D50.3-10): D50.10(3) R20.2
Net-(D50.4-12): D50.12(2) R17.1
Net-(D51.1-2): D51.2 R16.1
Net-(D51.6-13): D51.13(1) R45.2 VT5.2(C)
Net-(D52.1-3): D52.3 D52.12(1) D65.9(1)
Net-(D52.2-5): D52.5(2) D52.10(2) D56.6(3) D56.9(1) D56.12(1)
Net-(D52.2-6): D52.6(3) D53.21(WR-)
Net-(D52.3-8): D52.8(3) D53.18(CS-) D53.20(OE-)
Net-(D52.3-9): D52.9(1) R64.1 VT7.2(C)
Net-(D52.4-11): D52.11(3) D66.1(E) D66.13(E) D67.11(C)
Net-(D53-9): D53.9(D0) R70.2 VD12.2(K)
Net-(D53-10): D53.10(D1) R69.2 VD13.2(K)
Net-(D53-11): D53.11(D2) R68.2 VD14.2(K)
Net-(D53-13): D53.13(D3) R67.1 VD15.2(K)
Net-(D53-14): D53.14(D4) R66.1 VD16.2(K)
Net-(D56.1-3): D56.3 D56.4(1)
Net-(D61-12): D61.12(4) D65.13(2)
Net-(D62-9): D62.9(C) D64.13(3)
Net-(D63.1-2): D63.2 D64.2(1) D64.3(2) D65.11(3)
Net-(D63.3-9): D63.9(1) D64.4(3)
Net-(D63.3-10): D63.10(2) D64.10(3)
Net-(D63.4-12): D63.12(1) D64.1(3)
Net-(D65.2-6): D65.6(3) D66.9(I)
Net-(D66.2-5): D66.5(I) R84.1
Net-(D66.3-10): D66.10(E) D67.8(-Q)
Net-(R24-2): R24.2 VD26.1(A)
Net-(R25-2): R25.2 VD27.1(A)
Net-(R26-2): R26.2 VD28.1(A)
Net-(R27-1): R27.1 R28.1 R29.1 R30.1 VT1.3(B)
Net-(R33-1): R33.1 R33.2 R34.2 VT2.3(B)
Net-(R35-2): R35.2 VT2.1(E)
Net-(R37-1): R37.1 R37.2 R38.2 VT3.3(B)
Net-(R39-2): R39.2 VT3.1(E)
Net-(R41-2): R41.2 R41.3 R42.2 VT4.3(B)
Net-(R43-2): R43.2 VT4.1(E)
Net-(R44-1): R44.1 R45.1 VT5.3(B)
Net-(R48-1): R48.1 VT6.3(B)
Net-(R56-1): R56.1 VT6.2(C)
Net-(R63-2): R63.2 VD1.2(K) VD2.2(K) VD3.2(K) VD4.2(K) VD5.2(K) VT7.3(B)

Not connected (* = marked no-connect by the designer): D1 6(2)* 7(GND) 14(VCC); D2 5(VCC) 10(GND) 11(8)*; D3 8(GND) 13(B-)* 16(VCC); D4 8(GND) 13(B-)* 16(VCC); D5 7(GND) 14(VCC); D6 7(GND) 14(VCC); D7 7(GND) 14(VCC); D8 7(GND) 14(VCC); D9 7(GND) 14(VCC); D10 6(&#126;Q)* 7(GND) 9(Q)* 14(VCC); D11 5(VCC) 10(GND); D12 5(VCC) 10(GND); D13 11(VCC) 18(HALT)* 23(BSAK)* 29(GND); D14 8(GND) 16(VCC); D15 7(GND) 14(VCC); D16 8(GND) 16(VCC); D17 8(GND) 16(VCC); D18 8(GND) 16(VCC); D19 8(GND) 16(VCC); D20 8(VCC) 16(GND); D21 8(VCC) 16(GND); D22 8(VCC) 16(GND); D23 8(VCC) 16(GND); D24 8(VCC) 16(GND); D25 8(VCC) 16(GND); D26 8(VCC) 16(GND); D27 8(VCC) 16(GND); D28 8(VCC) 16(GND); D29 8(VCC) 16(GND); D30 8(VCC) 16(GND); D31 8(VCC) 16(GND); D32 8(VCC) 16(GND); D33 8(VCC) 16(GND); D34 8(VCC) 16(GND); D35 8(VCC) 16(GND); D36 14(GND) 28(VCC); D37 10(GND) 20(VCC); D38 10(GND) 20(VCC); D39 10(GND) 20(VCC); D40 10(GND) 20(VCC); D41 7(GND) 11(Q2)* 12(Q1)* 13(Q0)* 14(VCC); D42 7(GND) 11(Q2)* 12(Q1)* 13(Q0)* 14(VCC); D43 3(-Q1)* 6(-Q2)* 8(GND) 11(-Q3)* 14(-Q4)* 16(VCC); D44 2(1)* 4(2)* 10(GND) 16(2)* 18(1)* 20(VCC); D45 8(GND) 10(Q3)* 11(-Q3)* 12(D3)* 13(D4)* 14(-Q4)* 15(Q4)* 16(VCC); D46 8(GND) 16(VCC); D47 8(GND) 16(VCC); D48 7(R)* 8(RS)*; D49 7(GND) 14(VCC); D50 7(GND) 14(VCC); D51 7(GND) 14(VCC); D52 7(GND) 14(VCC); D53 12(GND) 15(D5)* 16(D6)* 17(D7)* 24(VCC); D54 12(GND) 24(VCC); D55 10(GND) 20(VCC); D56 7(GND) 14(VCC); D57 5(3)* 7(2)* 9(1)* 10(GND) 20(VCC); D58 5(3)* 7(2)* 9(1)* 10(GND) 20(VCC); D59 7(GND) 14(VCC); D60 7(GND) 8(5)* 14(VCC); D61 7(2)* 8(GND) 16(VCC); D62 8(GND) 16(VCC); D63 7(GND) 14(VCC); D64 7(GND) 14(VCC); D65 3* 7(GND) 14(VCC); D66 7(GND) 14(VCC); D67 5(Q)* 7(GND) 9(Q)* 14(VCC); X1 B1* B2* B3* B5* B6* B7* B8* B9* B27* B30* B31* B32* C1* C2* C3* C5* C6* C7* C9* C27* C30* C31* C32*; X3 10* 12* 13* 14* 15* 16* 17*; X7 4(+12)*

## Notes on the sheet
- 7МГц
- 3.5МГц
- 14МГц
- 875к
- 1.75МГц
- 437.5МГц
- 218.75К
- 15.6КГц
- Read Keyboard #FE
- RAM 128k
- ZX LPRINT III ROM
- CENTRONCS
- Port #EFFE
- Interface-II
- Interface-II
- Port #F7FE
- Port #7FFD
- Unused
- B0..B2 RAM Bank select
  SCR Select Screen
  ROM1 Select ROM 48/128
- RAM Page Selector
- LPrint
  Port #FB
- Keyboard Addresses
